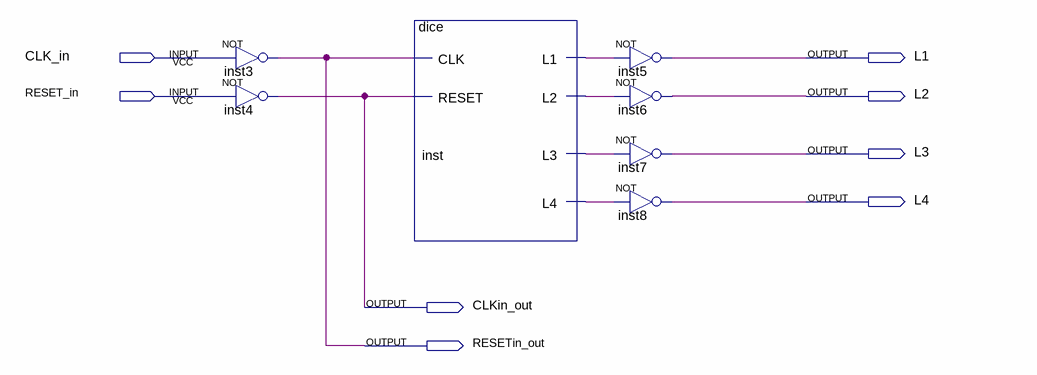
[diagram p0: schematic sheet]
// Quartus schematic interface_dice.bdf as structural Verilog: 7 symbols, 8 pins
module interface_dice (
  input  CLK_in,
  input  RESET_in,
  output L1,
  output L2,
  output L3,
  output L4,
  output CLKin_out,
  output RESETin_out
);

  wire inst_l1, inst_l2, inst_l3, inst_l4;

  not inst3 (RESETin_out, CLK_in);
  not inst4 (CLKin_out, RESET_in);
  dice inst (.CLK(RESETin_out), .RESET(CLKin_out), .L1(inst_l1), .L2(inst_l2), .L3(inst_l3), .L4(inst_l4));
  not inst5 (L1, inst_l1);
  not inst6 (L2, inst_l2);
  not inst7 (L3, inst_l3);
  not inst8 (L4, inst_l4);
endmodule
